# EAGLE design hallsensor (EAGLE 6.3)
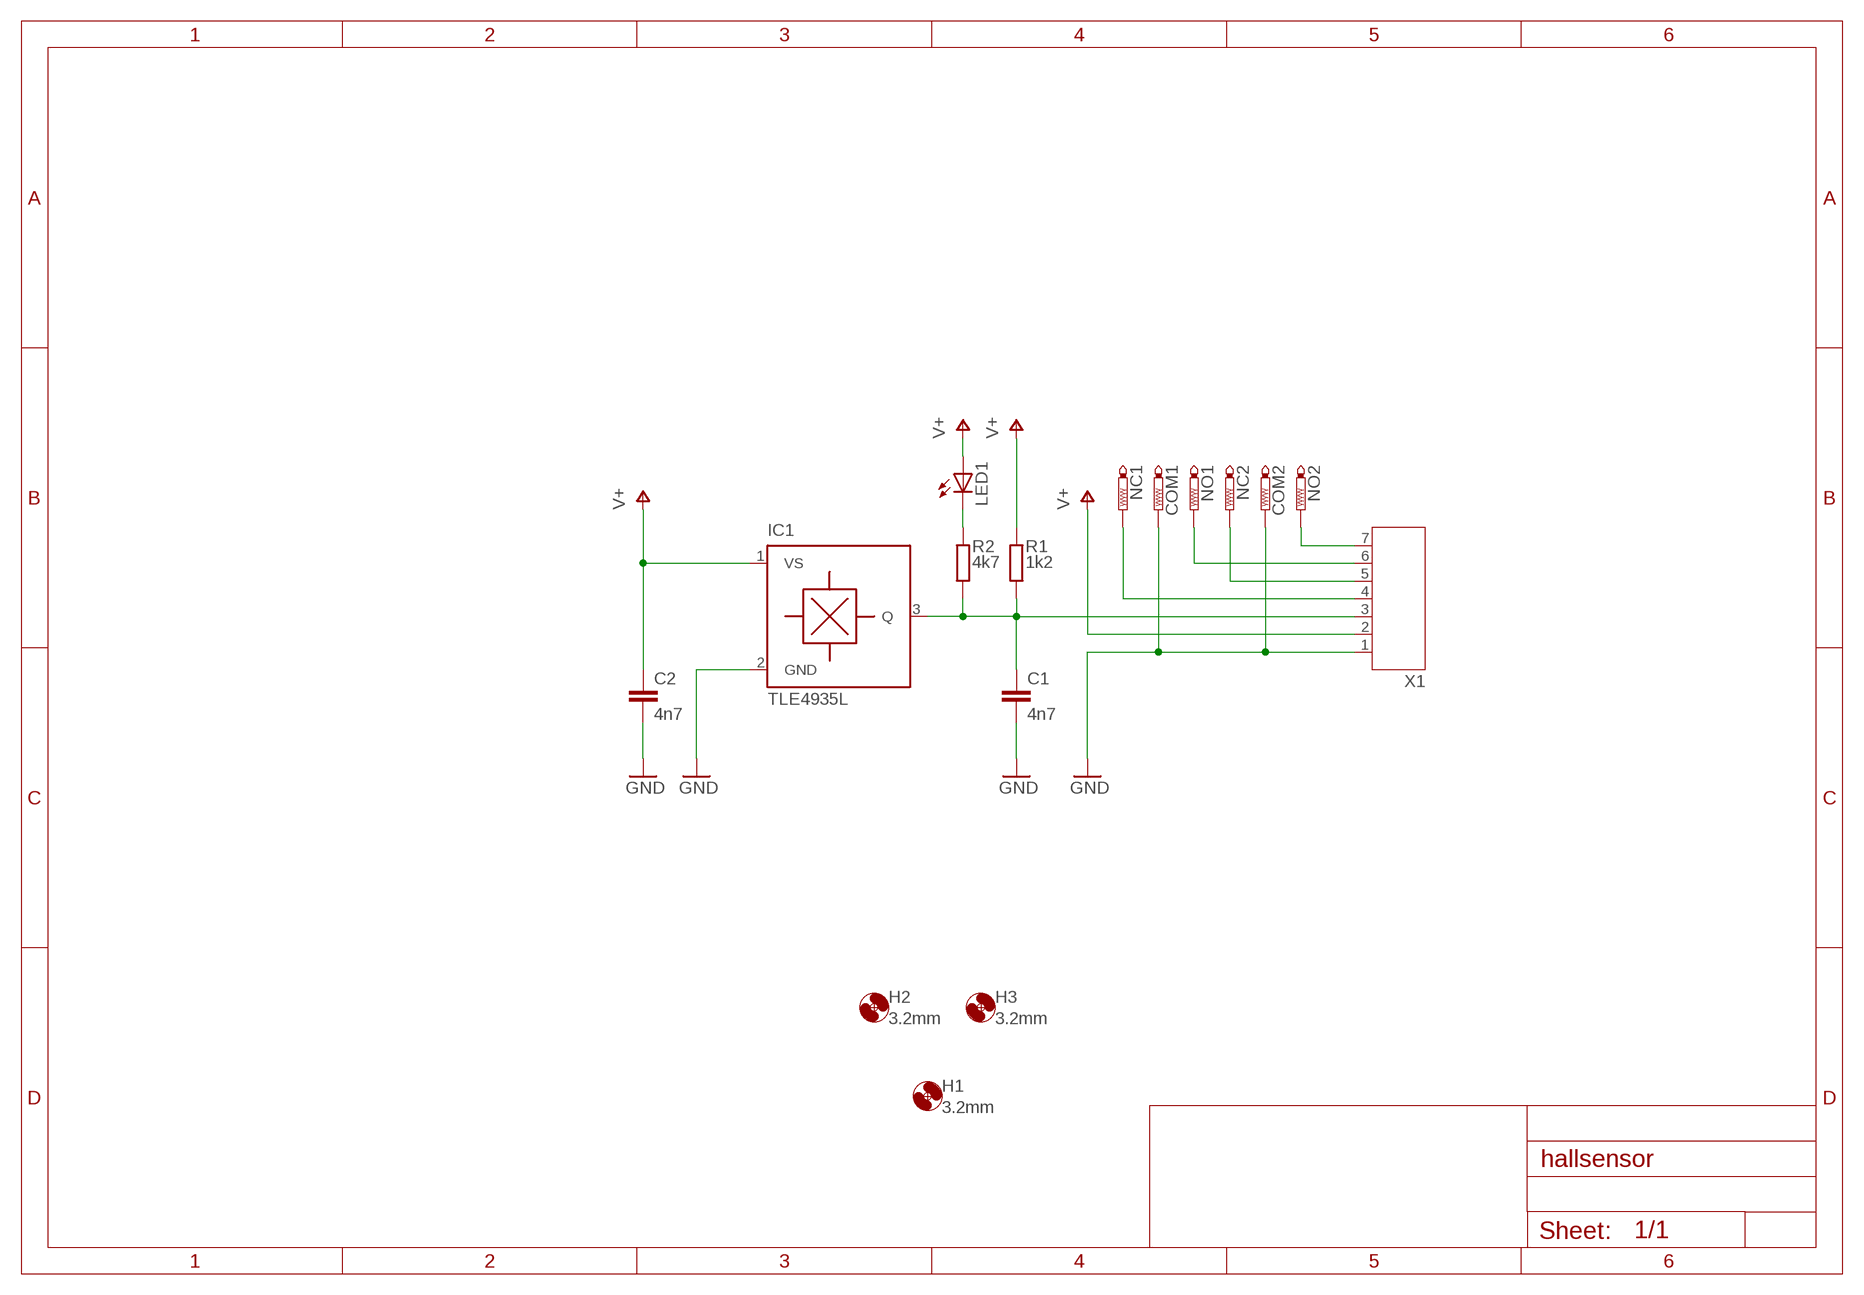
[diagram p0: schematic, sheet 1]

## Parts
C1  4n7  C-EUC0805  [C0805]
C2  4n7  C-EUC0805  [C0805]
COM1  PTR1PAD1-13Y  [P1-13Y]
COM2  PTR1PAD1-13Y  [P1-13Y]
H1  3.2mm  MOUNT-HOLE3.2  [3,2]
H2  3.2mm  MOUNT-HOLE3.2  [3,2]
H3  3.2mm  MOUNT-HOLE3.2  [3,2]
IC1  TLE4935L  TLE49X5L  [PG-SSO-3-2]
LED1  LED3MM  [LED3MM]
NC1  PTR1PAD1-13Y  [P1-13Y]
NC2  PTR1PAD1-13Y  [P1-13Y]
NO1  PTR1PAD1-13Y  [P1-13Y]
NO2  PTR1PAD1-13Y  [P1-13Y]
R1  1k2  R-EU_R0805  [R0805]
R2  4k7  R-EU_R0805  [R0805]
X1  JST-PH7  [JST-PH7]

## Nets
GND: C1.2 C2.2 COM1.1(TP) COM2.1(TP) IC1.2(GND) X1.1
N$1: LED1.K(C) R2.2
N$2: NC1.1(TP) X1.4
N$3: NO1.1(TP) X1.6
N$4: NC2.1(TP) X1.5
N$5: NO2.1(TP) X1.7
OUT: C1.1 IC1.3(Q) R1.1 R2.1 X1.3
V+: C2.1 IC1.1(VS) LED1.A R1.2 X1.2

## Library data of the parts
C1 C2 = rcl:C-EU: CAPACITOR, European symbol
COM1 COM2 NC1 NC2 NO1 NO2 = testpad:PTR1: TEST PIN
H1-H3 = holes:MOUNT-HOLE: MOUNTING HOLE with drill center marker
IC1 = infineon:TLE49X5L: Uni- and Bipolar Hall IC Switch for Magnetic Field Applications Features • Digital output signal • For unipolar and alternating magnetic fields • Large temperature range • Temperature compensated magnetic performance • Protection against reversed polarity • Output protection against electrical disturbances
LED1 = led:LED: LED OSRAM: - CHIPLED LG R971, LG N971, LY N971, LG Q971, LY Q971, LO R971, LY R971 LH N974, LH R974 LS Q976, LO Q976, LY Q976 LO Q996 - Hyper CHIPLED LW Q18S LB Q993, LB Q99A, LB R99A - SideLED LS A670, LO A670, LY A670, LG A670, LP A670 LB A673, LV A673, LT A673, LW A673 LH A674 LY A675 LS A676, LA A676, LO A676, LY A676, LW A676 LS A679, LY A679, LG A679 - Hyper Micro SIDELED® LS Y876, LA Y876, LO Y876, LY Y876 LT Y87S - SmartLED LW L88C, LW L88S LB L89C, LB L89S, LG L890 LS L89K, LO L89K, LY L89K LS L896, LA L896, LO L896, LY L896 - TOPLED LS T670, LO T670, LY T670, LG T670, LP T670 LSG T670, LSP T670, LSY T670, LOP T670, LYG T670 LG T671, LOG T671, LSG T671 LB T673, LV T673, LT T673, LW T673 LH T674 LS T676, LA T676, LO T676, LY T676, LB T676, LH T676, LSB T676, LW T676 LB T67C, LV T67C, LT T67C, LS T67K, LO T67K, LY T67K, LW E67C LS E67B, LA E67B, LO E67B, LY E67B, LB E67C, LV E67C, LT E67C LW T67C LS T679, LY T679, LG T679 LS T770, LO T770, LY T770, LG T770, LP T770 LB T773, LV T773, LT T773, LW T773 LH T774 LS E675, LA E675, LY E675, LS T675 LS T776, LA T776, LO T776, LY T776, LB T776 LHGB T686 LT T68C, LB T68C - Hyper Mini TOPLED® LB M676 - Mini TOPLED Santana® LG M470 LS M47K, LO M47K, LY M47K Source: http://www.osram.convergy.de LUXEON: - LUMILED® LXK2-PW12-R00, LXK2-PW12-S00, LXK2-PW14-U00, LXK2-PW14-V00 LXK2-PM12-R00, LXK2-PM12-S00, LXK2-PM14-U00 LXK2-PE12-Q00, LXK2-PE12-R00, LXK2-PE12-S00, LXK2-PE14-T00, LXK2-PE14-U00 LXK2-PB12-K00, LXK2-PB12-L00, LXK2-PB12-M00, LXK2-PB14-N00, LXK2-PB14-P00, LXK2-PB14-Q00 LXK2-PR12-L00, LXK2-PR12-M00, LXK2-PR14-Q00, LXK2-PR14-R00 LXK2-PD12-Q00, LXK2-PD12-R00, LXK2-PD12-S00 LXK2-PH12-R00, LXK2-PH12-S00 LXK2-PL12-P00, LXK2-PL12-Q00, LXK2-PL12-R00 Source: www.luxeon.com KINGBRIGHT: KA-3528ASYC Source: www.kingbright.com
R1 R2 = rcl:R-EU_: RESISTOR, European symbol
X1 = jst-ph-xh:JST-PH7

## Board
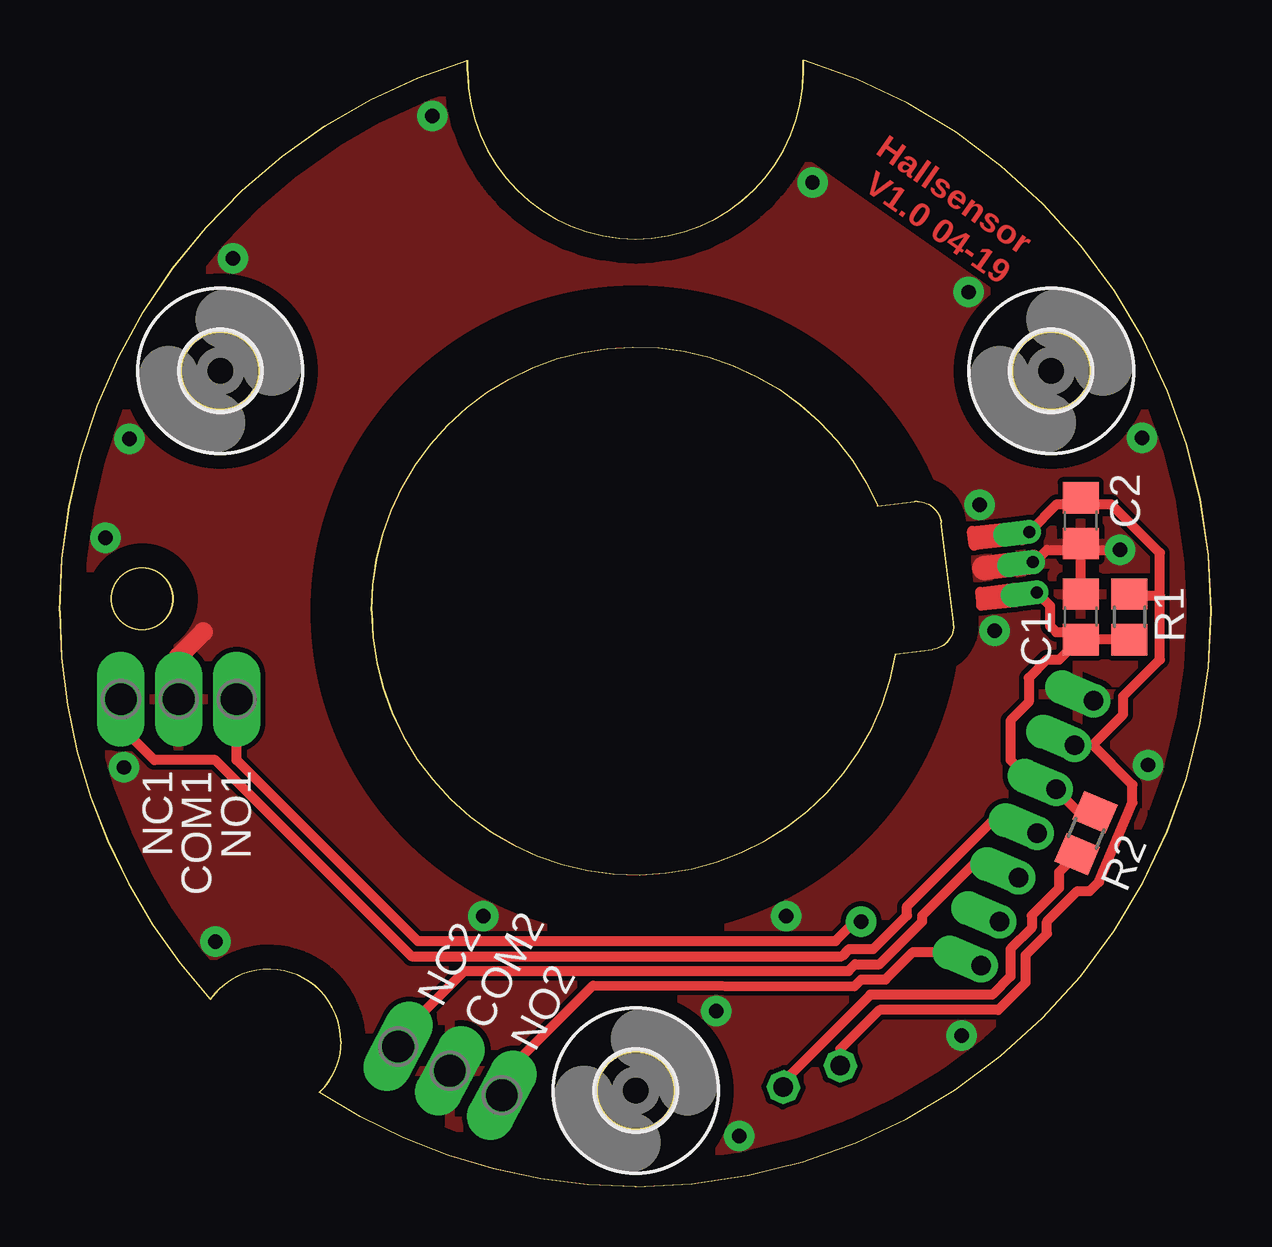
[diagram p1: board, top side]
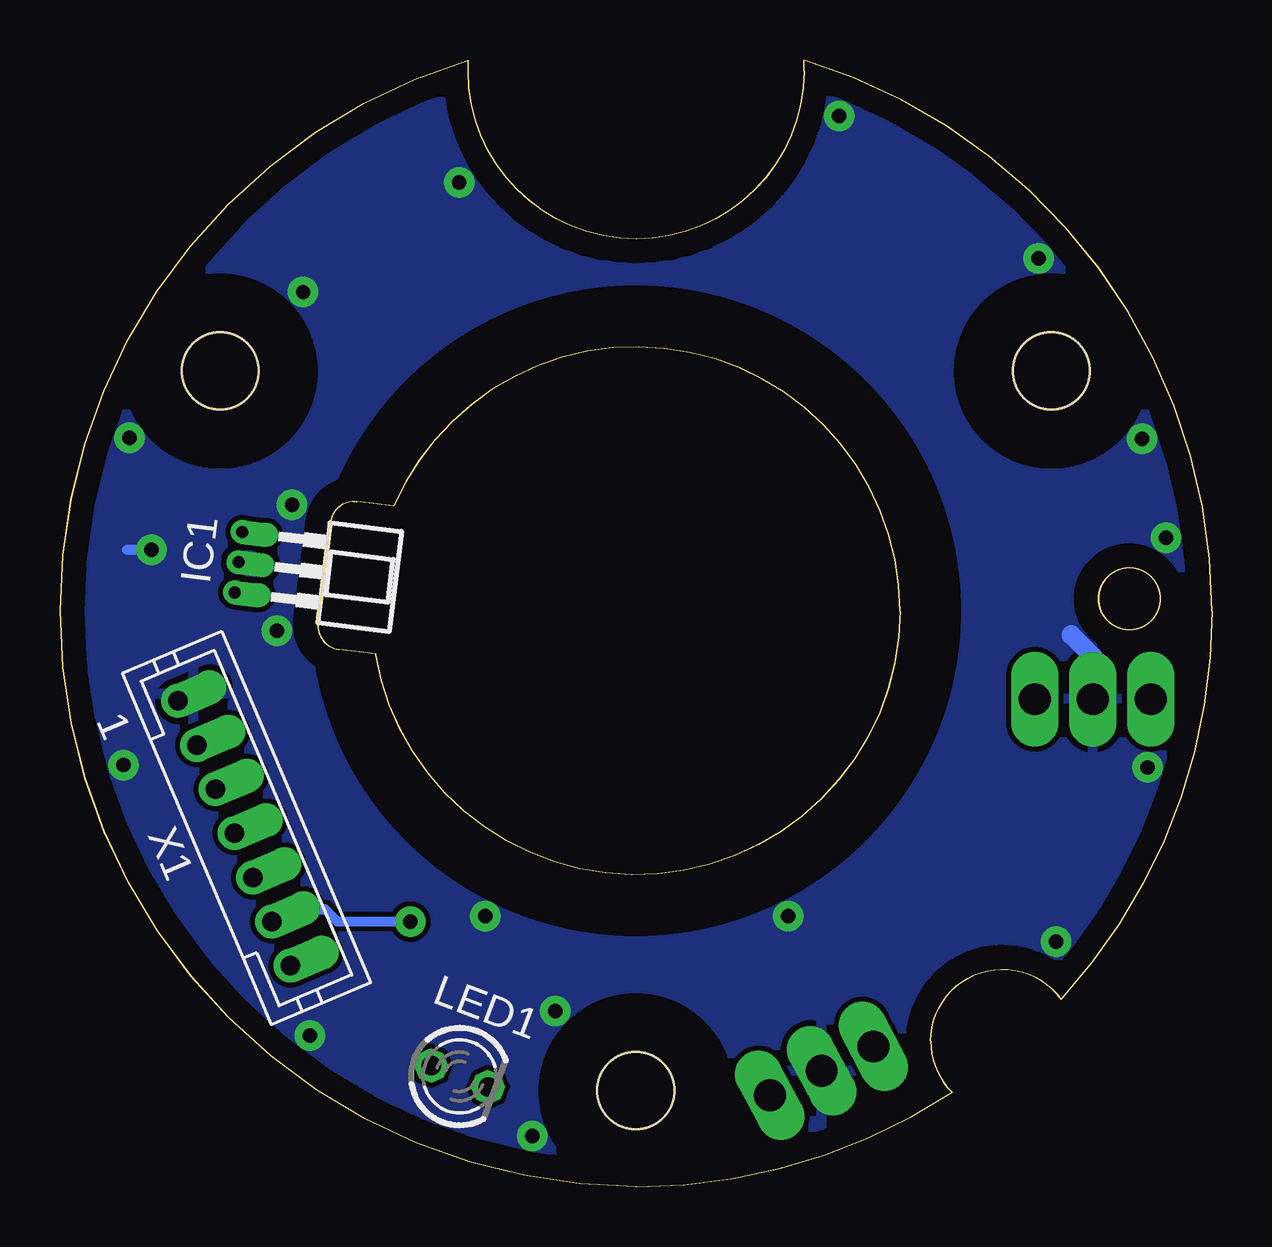
[diagram p2: board, bottom side, seen from below]

Size 48 x 46.96 mm. Coordinates in mm from the lower left corner, seen from the top.
Outline: 24,0 arc-33 10.83,3.93 arc45 11.72,6.06 arc144 6.28,7.81 arc-42 0,24 arc-73 17,46.96 17,46.5 arc180 31,46.5 31,46.96 arc-163 24,0
Outline: 37.26,23.51 36.75,27.68 arc83 35.76,28.55 arc7 35.63,28.55 34.1,28.36 34.09,28.39 arc156 13,24 arc170 34.85,22.18 34.86,22.21 36.39,22.39 arc83 37.27,23.39 arc7 37.26,23.51
Outline: circle at 3.44,24.5 radius 1.28
Copper layers (1*16): Top 0.035mm / dielectric 1.5mm / Bottom 0.035mm
Design rules "default *": minimum track width 10mil, minimum drill 15mil, track to track 8mil, track to pad 8mil, pad to pad 8mil, via to via 8mil, smd to smd 8mil, copper to edge 40mil, drill to drill 8mil, minimum pad ring 10mil, minimum via ring 8mil, stop-mask expansion 4mil, vias tented up to drill 60mil, thermal gap 10mil
tRestrict: area 10.5,10.5 to 37.5,37.5; 1 lines
bRestrict: area 10.5,10.5 to 37.5,37.5; 8 lines
Milling: area 2.1,23.2 to 4.7,25.8; 20 lines

### Footprints (pad centres in the part's own frame; a part is rotated, then mirrored left to right if it is on the bottom)
C0805 = smd 1.3 x 1.5: 1 -0.95,0; 2 0.95,0
P1-13Y = drill 1.321 pad 1.905 long: 1 0,0
3,2 = hole 3.2: 0,0
PG-SSO-3-2 = drill 0.5 offset: 1 -1.27,-5.08; 2 0,-5.08; 3 1.27,-5.08
LED3MM = drill 0.813 octagon: A -1.27,0; K 1.27,0
R0805 = smd 1.3 x 1.5: 1 -0.95,0; 2 0.95,0
JST-PH7 = drill 0.813 pad 1.422 offset: 1 -6,0; 2 -4,0; 3 -2,0; 4 0,0; 5 2,0; 6 4,0; 7 6,0

### Placement (x,y rotation side)
C1  42.54,23.75 90 top
C2  42.54,27.76 270 top
COM1  4.95,20.32 0 top
COM2  16.25,4.82 332 top
H1  24,4 0 top
H2  41.32,34 0 top
H3  6.68,34 0 top
IC1  35.51,25.41 263 bottom
LED1  31.34,4.59 339.3 bottom
NC1  2.54,20.32 0 top
NC2  14.09,5.84 332 top
NO1  7.36,20.32 0 top
NO2  18.41,3.81 332 top
R1  44.57,23.75 90 top
R2  42.77,14.73 247 top
X1  40.73,14.72 293 bottom

### Tracks (layer width: path | path; a pad name or v marks a point on that pad's centre or on a via)
GND  (via drill 0.6 pad 1.27)
  Top 0.406: C1.2 42.54,26.54 | IC1.2 40.63,26.03 41.14,26.54 42.54,26.54 | 42.54,26.54 v44.19,26.54 | C2.2 42.54,26.54
  Top 0.813: COM1.1 4.95,22.09 5.97,23.11
  Top 1.016: IC1.2 38.53,25.78
  Bottom 0.406: v44.19,26.54 45.21,26.54
  Bottom 0.813: COM1.1 4.95,22.09 5.84,22.98
  other vias: 38.96,23.16 30.27,11.27 27.35,7.31 37.59,6.3 45.36,17.57 45.11,31.21 28.32,2.11 6.47,10.21 2.66,17.47 1.9,27.05 2.89,31.16 7.21,38.68 15.52,44.62 31.37,41.86 37.87,37.28 17.65,11.27 38.33,28.42
  pour Bottom: 0.38,23.87 0.38,24 arc-90 23.75,47.37 24.25,47.37 arc-90 47.37,24.64 47.37,23.75 arc-90 24.76,0.5 23.62,0.5 arc-90
  pour Top: 24,46.48 25.14,46.48 arc-90 47.37,24.25 47.37,23.87 arc-90 24.13,0.63 23.87,0.63 arc-90 0.5,24 0.5,24.13 arc-90 22.86,46.48
N$1
  Top 0.406: R2.2 41.65,13.11 41.65,12.44 40.51,11.3 40.51,10.79 39.62,9.9 39.62,8.76 38.86,8 33.78,8 30.15,4.37 LED1.K
N$2
  Top 0.406: X1.4 40.1,15.36 38.99,15.36 35.3,11.68 35.3,11.3 33.91,9.9 32.89,9.9 32.59,9.6 14.65,9.6 6.47,17.78 3.93,17.78 2.54,19.17 NC1.1
N$3  (via drill 0.6 pad 1.27)
  Top 0.406: v33.4,11.05 33.14,11.05 32.33,10.23 14.91,10.23 7.36,17.78 NO1.1
  Bottom 0.406: X1.6 38.66,11.55 36.95,11.55 36.45,11.05 v33.4,11.05
N$4
  Top 0.406: X1.5 39.38,13.46 38.1,13.46 35.94,11.3 35.94,11.05 34.16,9.27 33.14,9.27 32.87,8.99 16.86,8.99 14.09,6.22 NC2.1
N$5
  Top 0.406: NO2.1 18.41,4.57 22.22,8.38 33.12,8.35 33.4,8.63 34.41,8.63 35.56,9.78 37.82,9.78 X1.7
OUT
  Top 0.406: R1.1 C1.1 | C1.1 42.54,22.73 | R2.1 42.48,15.6 X1.3 41.07,17.02 40.38,17.02 39.62,17.78 39.62,19.43 40.38,20.19 40.38,21.21 41.14,21.97 41.65,21.97 42.48,22.8 C1.1 | C1.1 42.35,22.8 42.03,23.11 41.53,23.11 41.27,23.36 41.27,24.21 IC1.3 38.55,24.51 38.55,24.58 38.35,24.79 | 38.35,24.79 39.77,24.96 39.82,24.36 38.4,24.2 38.35,24.79
V+
  Top 0.406: X1.2 43.05,18.41 | 43.05,18.41 44.32,19.68 44.32,20.44 45.84,21.97 45.84,24.64 | 45.84,24.64 45.84,26.41 43.81,28.45 42.54,28.45 | 43.05,18.41 44.7,16.75 44.7,16 43.3,12.7 42.92,12.32 42.41,12.32 41.14,11.05 41.14,10.54 40.26,9.65 40.26,8.51 39.11,7.36 34.16,7.36 32.53,5.73 LED1.A | 42.54,28.45 41.56,28.45 IC1.1 40.1,26.95 38.1,26.72 38.02,27.33 39.9,27.53 39.9,27.2 38.3,27.05 38.35,27.05 | C2.1 42.54,28.45 | R1.2 44.64,24.64 45.84,24.64

### Text on the board
Top: Hallsensor / V1.0 04-19